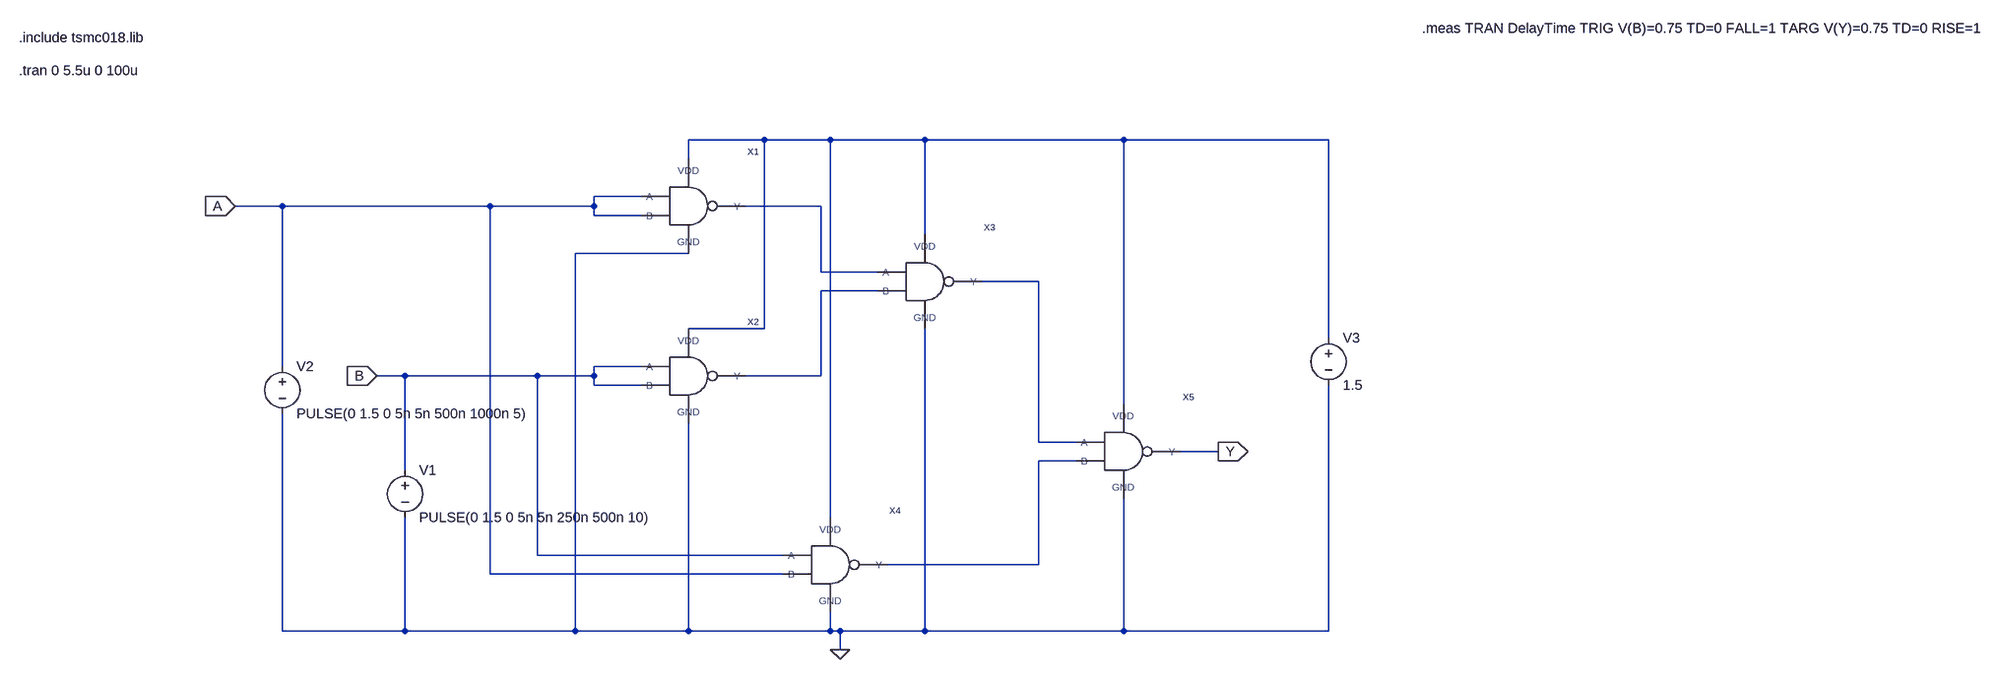
[diagram p0: schematic xnor_with_nand.asc]
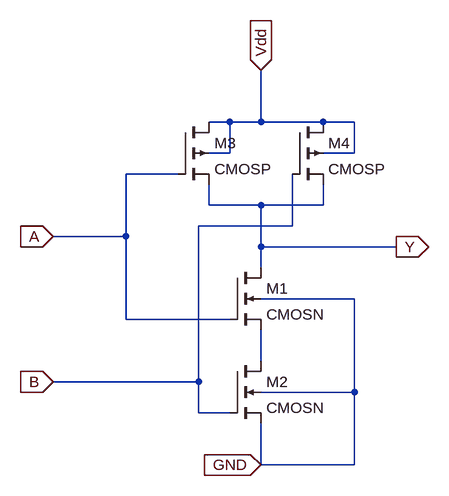
[diagram p1: sub-circuit cmos_nand.asc]
xnor_with_nand.asc, the LTspice schematic file:
Version 4
SHEET 1 2604 852
WIRE 256 -32 128 -32
WIRE 368 -32 256 -32
WIRE 528 -32 368 -32
WIRE 864 -32 528 -32
WIRE 1216 -32 864 -32
WIRE 128 0 128 -32
WIRE 48 64 -32 64
WIRE -560 80 -640 80
WIRE -208 80 -560 80
WIRE -32 80 -32 64
WIRE -32 80 -208 80
WIRE 352 80 224 80
WIRE -32 96 -32 80
WIRE 48 96 -32 96
WIRE 528 128 528 -32
WIRE 128 160 -64 160
WIRE 352 192 352 80
WIRE 448 192 352 192
WIRE 720 208 624 208
WIRE 448 224 352 224
WIRE 256 288 256 -32
WIRE 256 288 128 288
WIRE 1216 304 1216 -32
WIRE -560 352 -560 80
WIRE 48 352 -32 352
WIRE -352 368 -400 368
WIRE -128 368 -352 368
WIRE -32 368 -32 352
WIRE -32 368 -128 368
WIRE 352 368 352 224
WIRE 352 368 224 368
WIRE -32 384 -32 368
WIRE 48 384 -32 384
WIRE 864 416 864 -32
WIRE 720 480 720 208
WIRE 784 480 720 480
WIRE 1024 496 960 496
WIRE 784 512 720 512
WIRE -352 528 -352 368
WIRE 368 608 368 -32
WIRE -128 672 -128 368
WIRE 288 672 -128 672
WIRE 720 688 720 512
WIRE 720 688 464 688
WIRE -208 704 -208 80
WIRE 288 704 -208 704
WIRE -560 800 -560 432
WIRE -352 800 -352 608
WIRE -352 800 -560 800
WIRE -64 800 -64 160
WIRE -64 800 -352 800
WIRE 128 800 128 448
WIRE 128 800 -64 800
WIRE 368 800 368 768
WIRE 368 800 128 800
WIRE 384 800 368 800
WIRE 528 800 528 288
WIRE 528 800 384 800
WIRE 864 800 864 576
WIRE 864 800 528 800
WIRE 1216 800 1216 384
WIRE 1216 800 864 800
WIRE 384 832 384 800
FLAG 1024 496 Y
IOPIN 1024 496 Out
FLAG 384 832 0
FLAG -640 80 A
IOPIN -640 80 In
FLAG -400 368 B
IOPIN -400 368 In
SYMBOL cmos_NAND 128 48 R0
SYMATTR InstName X1
SYMBOL cmos_NAND 128 336 R0
SYMATTR InstName X2
SYMBOL cmos_NAND 528 176 R0
SYMATTR InstName X3
SYMBOL cmos_NAND 368 656 R0
SYMATTR InstName X4
SYMBOL cmos_NAND 864 464 R0
SYMATTR InstName X5
SYMBOL voltage -352 512 R0
WINDOW 123 0 0 Left 0
WINDOW 39 0 0 Left 0
SYMATTR InstName V1
SYMATTR Value PULSE(0 1.5 0 5n 5n 250n 500n 10)
SYMBOL voltage -560 336 R0
WINDOW 123 0 0 Left 0
WINDOW 39 0 0 Left 0
SYMATTR InstName V2
SYMATTR Value PULSE(0 1.5 0 5n 5n 500n 1000n 5)
SYMBOL voltage 1216 288 R0
WINDOW 123 0 0 Left 0
WINDOW 39 0 0 Left 0
SYMATTR InstName V3
SYMATTR Value 1.5
TEXT -1224 -304 Left 2 !.include tsmc018.lib
TEXT -1224 -248 Left 2 !.tran 0 5.5u 0 100u
TEXT 1608 -320 Left 2 !.meas TRAN DelayTime TRIG V(B)=0.75 TD=0 FALL=1 TARG V(Y)=0.75 TD=0 RISE=1

cmos_nand.asc, the sub-circuit schematic file:
Version 4
SHEET 1 880 680
WIRE 224 -144 192 -144
WIRE 272 -144 272 -224
WIRE 272 -144 224 -144
WIRE 368 -144 272 -144
WIRE 416 -144 368 -144
WIRE 224 -96 224 -144
WIRE 224 -96 192 -96
WIRE 416 -96 416 -144
WIRE 416 -96 368 -96
WIRE 144 -64 64 -64
WIRE 192 -16 192 -48
WIRE 272 -16 192 -16
WIRE 368 -16 368 -48
WIRE 368 -16 272 -16
WIRE 320 16 320 -64
WIRE 320 16 176 16
WIRE 64 32 64 -64
WIRE 64 32 -48 32
WIRE 272 48 272 -16
WIRE 480 48 272 48
WIRE 272 80 272 48
WIRE 416 128 272 128
WIRE 64 160 64 32
WIRE 224 160 64 160
WIRE 272 224 272 176
WIRE 176 256 176 16
WIRE 176 256 -48 256
WIRE 416 272 416 128
WIRE 416 272 272 272
WIRE 176 304 176 256
WIRE 224 304 176 304
WIRE 272 384 272 320
WIRE 416 384 416 272
WIRE 416 384 272 384
FLAG 480 48 Y
IOPIN 480 48 Out
FLAG -48 32 A
IOPIN -48 32 In
FLAG -48 256 B
IOPIN -48 256 In
FLAG 272 -224 Vdd
IOPIN 272 -224 In
FLAG 272 384 GND
IOPIN 272 384 In
SYMBOL cmosn 224 80 R0
SYMATTR InstName M1
SYMBOL cmosn 224 224 R0
SYMATTR InstName M2
SYMBOL cmosp 144 -144 R0
SYMATTR InstName M3
SYMBOL cmosp 320 -144 R0
SYMATTR InstName M4

The netlist it stands for:
* xnor_with_nand.asc
XX1 N001 0 A A N002 cmos_nand
XX2 N001 0 B B N004 cmos_nand
XX3 N001 0 N002 N004 N003 cmos_nand
XX4 N001 0 B A N005 cmos_nand
XX5 N001 0 N003 N005 Y cmos_nand
V1 B 0 PULSE(0 1.5 0 5n 5n 250n 500n 10)
V2 A 0 PULSE(0 1.5 0 5n 5n 500n 1000n 5)
V3 N001 0 1.5

* block symbol definitions
.subckt cmos_nand VDD GND A B Y
M1 Y A N001 GND CMOSN
M2 N001 B GND GND CMOSN
M3 Vdd A Y Vdd CMOSP
M4 Vdd B Y Vdd CMOSP
.ends cmos_nand

.model NMOS NMOS
.model PMOS PMOS
.lib standard.mos
.include tsmc018.lib
.tran 0 5.5u 0 100u
.meas TRAN DelayTime TRIG V(B)=0.75 TD=0 FALL=1 TARG V(Y)=0.75 TD=0 RISE=1
.backanno
.end